# EAGLE design photoduino.solenoid.valve.interface.v.1.0 (EAGLE 6.1)
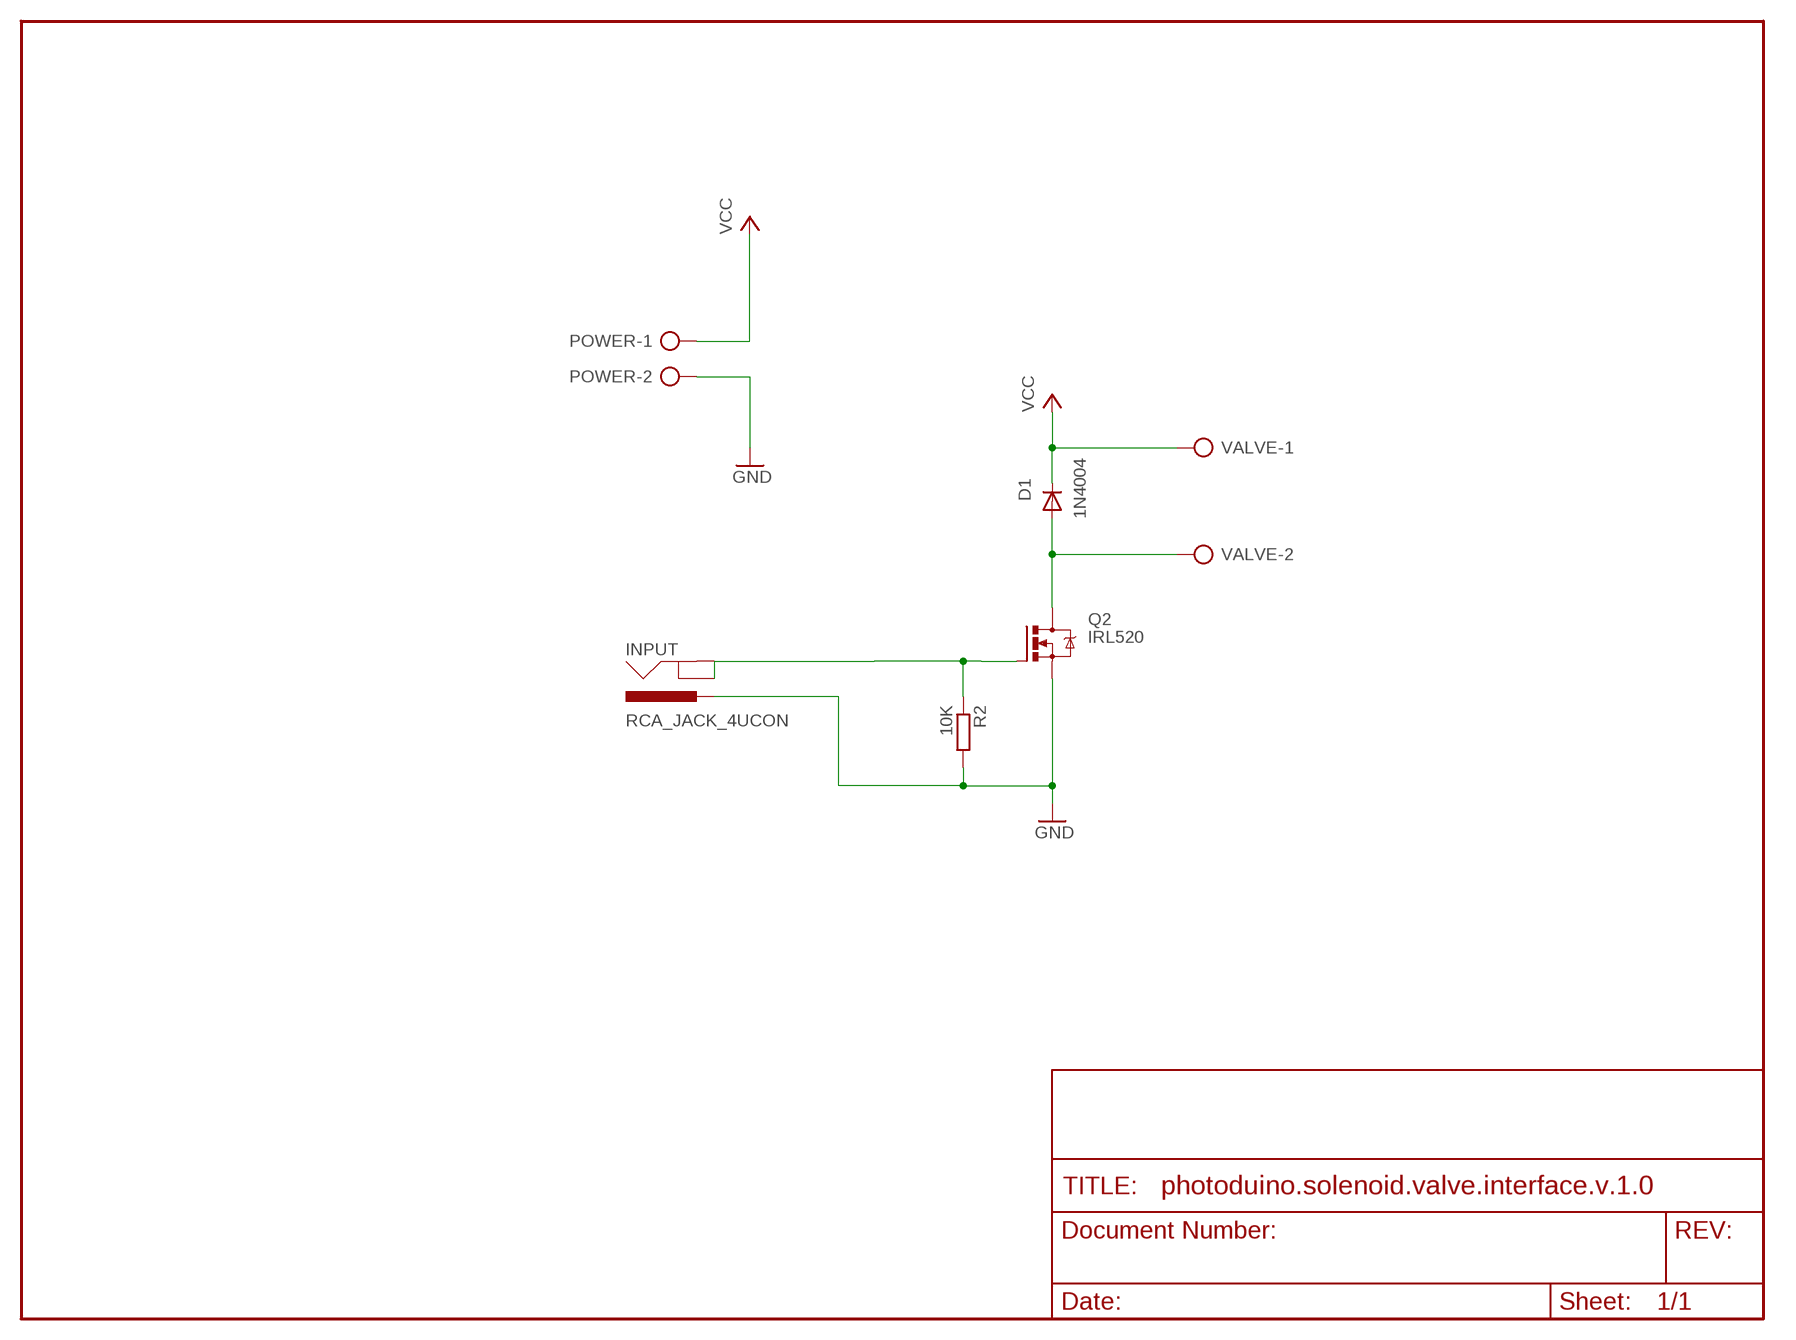
[diagram p0: schematic, sheet 1]

## Parts
D1  1N4004  [DO41-10]
INPUT  RCA_JACK_4UCON  [RCA_4UCON]
POWER  AK500/2  [AK500/2]
Q2  IRL520  IRLZ44Z  [TO220BH]
R2  10K  R-EU_0207/7  [0207/7]
VALVE  AK500/2  [AK500/2]

## Nets
GND: INPUT.BARREL POWER.2 Q2.S R2.2
N$2: INPUT.BREAK INPUT.SPRING Q2.G R2.1
N$3: D1.A Q2.D VALVE.2
VCC: D1.C POWER.1 VALVE.1

## Library data of the parts
D1 = diode:1N4004: DIODE general purpose rectifier, 1 A
INPUT = componentes:RCA_JACK_4UCON
POWER VALVE = con-ptr500:AK500/2: CONNECTOR; OC_FARNELL: unknown; OC_NEWARK: unknown
Q2 = transistor-power:IRLZ44Z: N-Channel HEXFET® Power MOSFET Logic Level AUTOMOTIVE MOSFET Source: http://www.irf.com/product-info/datasheets/data/irlz44zpbf.pdf
R2 = resistor:R-EU_: RESISTOR, European symbol

## Board
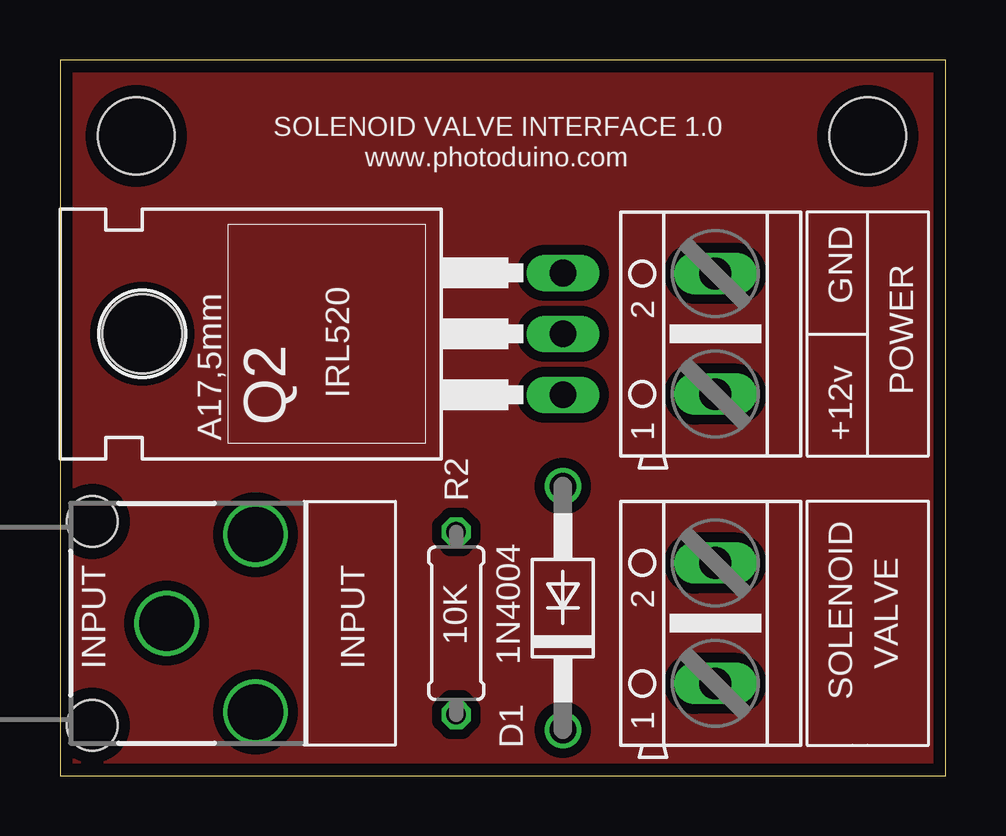
[diagram p1: board, top side]
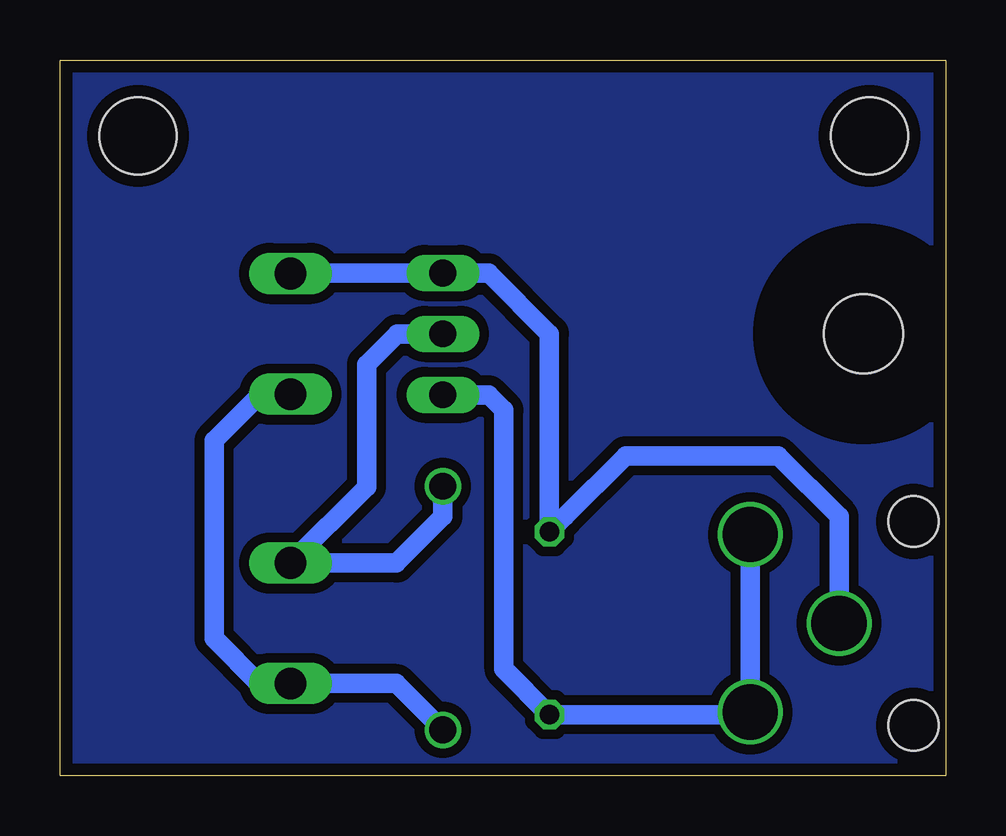
[diagram p2: board, bottom side, seen from below]

Size 36.91 x 29.84 mm. Coordinates in mm from the lower left corner, seen from the top.
Outline: 0,0 36.91,0 36.91,29.84 0,29.84 0,0
Copper layers (1*16): Top 0.035mm / dielectric 1.5mm / Bottom 0.035mm
Design rules "default *": minimum track width 8mil, minimum drill 0.3mm, track to track 8mil, track to pad 8mil, pad to pad 8mil, via to via 8mil, smd to smd 8mil, copper to edge 20mil, drill to drill 8mil, minimum pad ring 8mil, minimum via ring 4mil, stop-mask expansion 3mil, vias tented up to drill 0mil, thermal gap 8mil
Holes 3.2 mm at 33.66,26.67 3.17,26.67

### Footprints (pad centres in the part's own frame; a part is rotated, then mirrored left to right if it is on the bottom)
DO41-10 = drill 1.118 round: A 5.08,0; C -5.08,0
RCA_4UCON = drill 2.3 round: BARREL 0,0; BREAK 3.7,3.7; SPRING 3.7,-3.7 | hole 2.1: -3.1,4.25; -3.1,-4.25
AK500/2 = drill 1.321 long: 1 -2.515,0; 2 2.515,0
TO220BH = drill 1.118 long: D 0,-6.35; G -2.54,-6.35; S 2.54,-6.35 | hole 3.302: 0,11.176
0207/7 = drill 0.813 octagon: 1 -3.81,0; 2 3.81,0

### Placement (x,y rotation side)
D1  20.95,6.99 90 top
INPUT  4.45,6.35 0 top
POWER  27.3,18.41 90 top
Q2  14.61,18.41 90 top
R2  16.51,6.35 90 top
VALVE  27.3,6.35 90 top

### Tracks (layer width: path | path; a pad name or v marks a point on that pad's centre or on a via)
GND
  Bottom 0.813: INPUT.BARREL 4.45,10.79 6.99,13.34 13.34,13.34 15.88,10.79 R2.2 16.51,18.41 19.05,20.95 Q2.S 27.28,20.95 POWER.2
N$2
  Bottom 0.813: INPUT.BREAK INPUT.SPRING 8.26,2.54 R2.1 18.41,4.45 18.41,15.24 19.05,15.88 Q2.G
N$3
  Bottom 0.813: D1.A 20.95,10.79 22.89,8.87 VALVE.2 24.13,12.04 24.13,15.24 24.13,17.14 22.86,18.41 Q2.D
N$7
  pour Bottom (isolate 0.406): 0,29.84 36.83,29.84 36.83,0 0,0
N$8
  pour Top (isolate 0.406): 0,29.84 36.83,29.84 36.83,0 0,0
VCC
  Bottom 0.813: D1.C 22.89,3.83 VALVE.1 27.33,3.81 28.57,3.81 30.48,5.71 30.48,13.97 28.55,15.9 POWER.1

### Text on the board
tPlace: SOLENOID VALVE INTERFACE 1.0 | www.photoduino.com
tNames: GND | POWER | +12v | INPUT | VALVE | SOLENOID